# EAGLE design rgb_sensor (EAGLE 6.4)
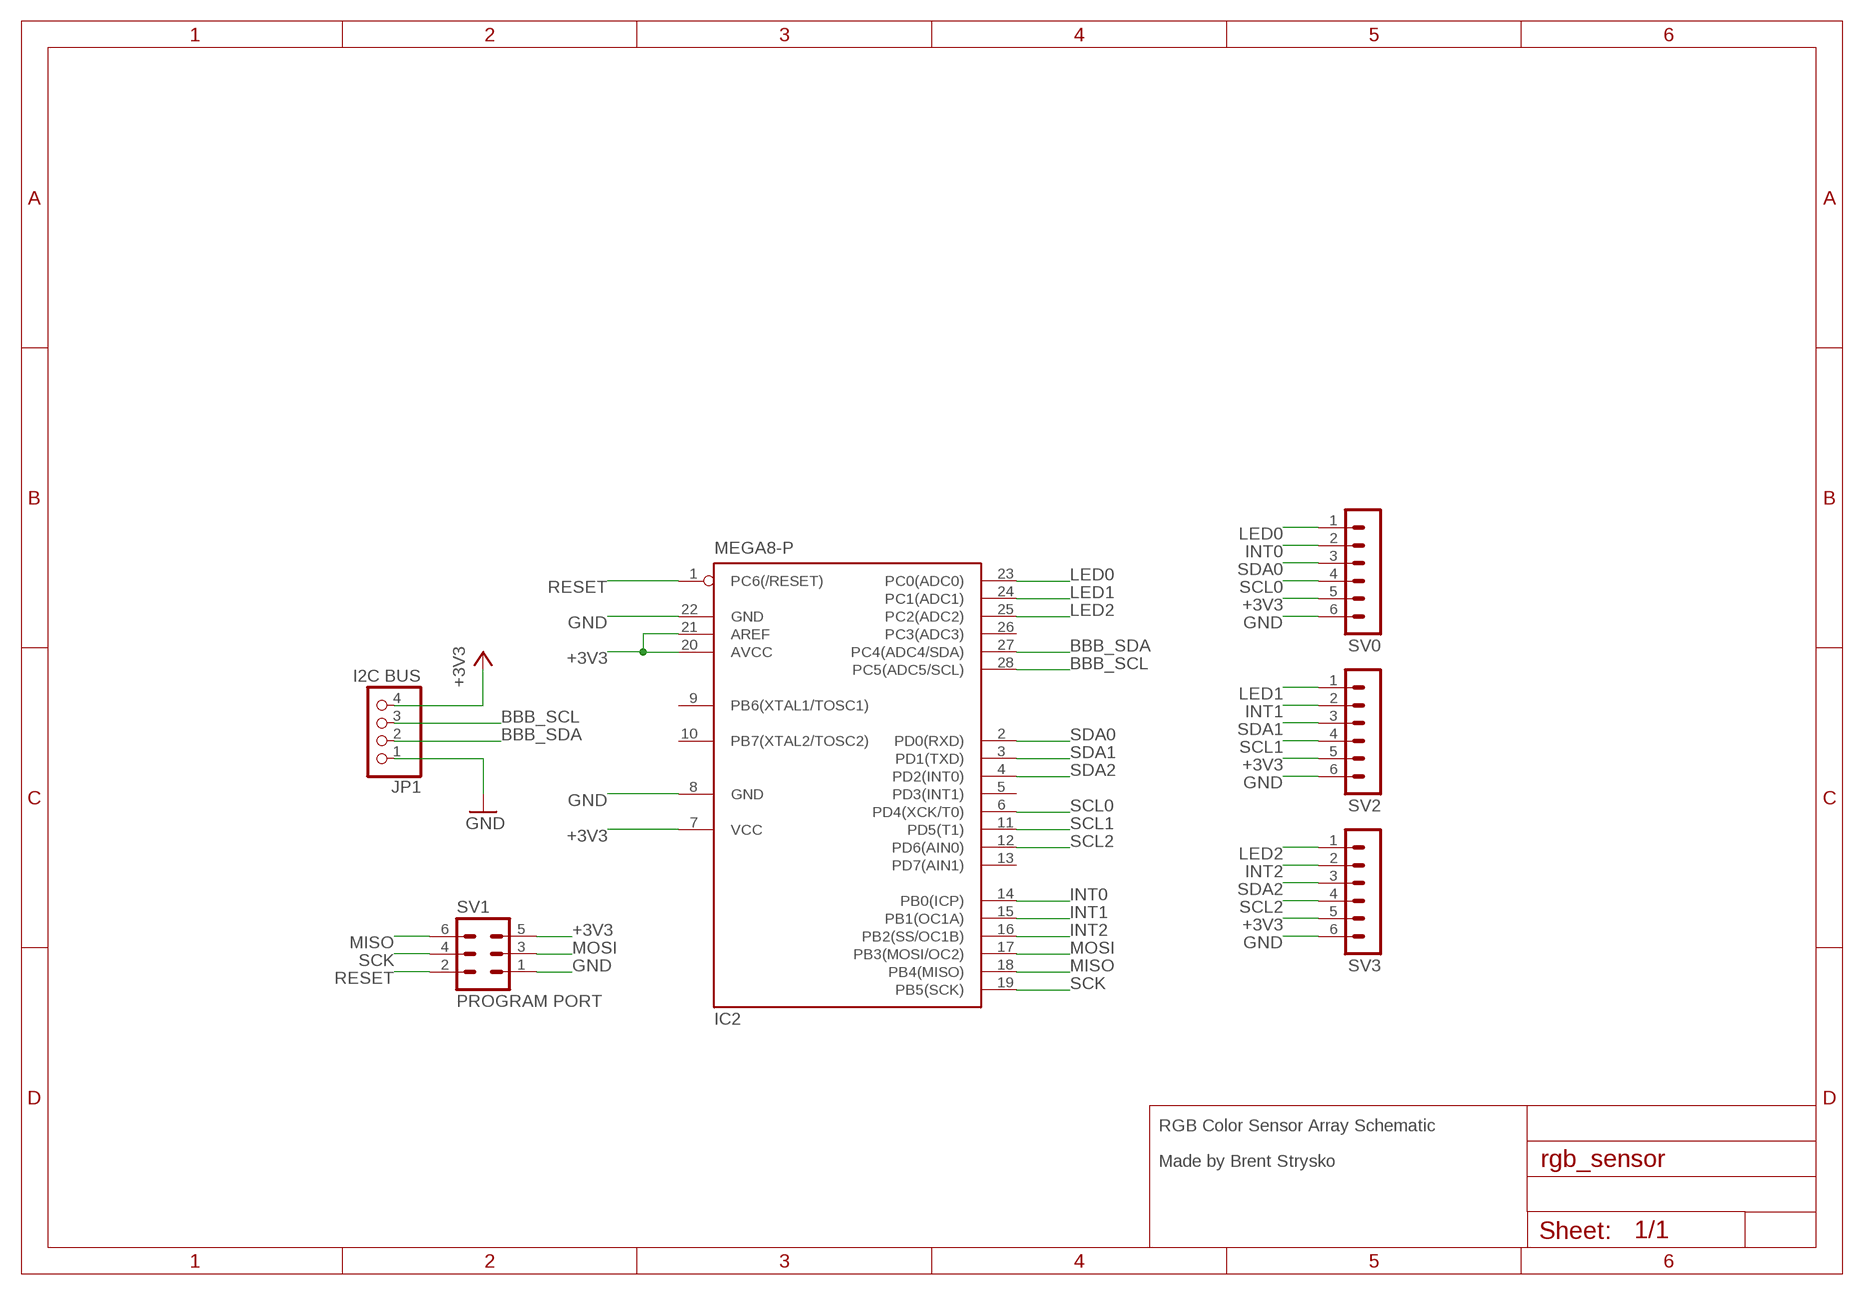
[diagram p0: schematic, sheet 1]

## Parts
IC2  MEGA8-P  [DIL28-3]
JP1  I2C BUS  PINHD-1X4  [1X04]
SV0  MA06-1  [MA06-1]
SV1  PROGRAM PORT  MA03-2  [MA03-2]
SV2  MA06-1  [MA06-1]
SV3  MA06-1  [MA06-1]

## Nets
+3V3: IC2.7(VCC) IC2.20(AVCC) IC2.21(AREF) JP1.4 SV0.5 SV1.5 SV2.5 SV3.5
BBB_SCL: IC2.28(PC5(ADC5/SCL)) JP1.3
BBB_SDA: IC2.27(PC4(ADC4/SDA)) JP1.2
GND: IC2.8(GND) IC2.22(GND) JP1.1 SV0.6 SV1.1 SV2.6 SV3.6
INT0: IC2.14(PB0(ICP)) SV0.2
INT1: IC2.15(PB1(OC1A)) SV2.2
INT2: IC2.16(PB2(SS/OC1B)) SV3.2
LED0: IC2.23(PC0(ADC0)) SV0.1
LED1: IC2.24(PC1(ADC1)) SV2.1
LED2: IC2.25(PC2(ADC2)) SV3.1
MISO: IC2.18(PB4(MISO)) SV1.6
MOSI: IC2.17(PB3(MOSI/OC2)) SV1.3
RESET: IC2.1(PC6(/RESET)) SV1.2
SCK: IC2.19(PB5(SCK)) SV1.4
SCL0: IC2.6(PD4(XCK/T0)) SV0.4
SCL1: IC2.11(PD5(T1)) SV2.4
SCL2: IC2.12(PD6(AIN0)) SV3.4
SDA0: IC2.2(PD0(RXD)) SV0.3
SDA1: IC2.3(PD1(TXD)) SV2.3
SDA2: IC2.4(PD2(INT0)) SV3.3
Unconnected: IC2.5(PD3(INT1)) IC2.9(PB6(XTAL1/TOSC1)) IC2.10(PB7(XTAL2/TOSC2)) IC2.13(PD7(AIN1)) IC2.26(PC3(ADC3))

## Notes on the sheet
- RGB Color Sensor Array Schematic
- Made by Brent Strysko

## Library data of the parts
IC2 = atmel:MEGA8-P: MICROCONTROLLER 8 Kbytes FLASH, 1 kbytes SRAM, 512 bytes EEPROM, USART, 4-channel 10 bit ADC, 2-channel 8 bit ADC Pin compatible with Atmega48, ATMega88, ATMega168 Source: avr.lbr; OC_FARNELL: unknown; OC_NEWARK: unknown
JP1 = pinhead:PINHD-1X4: PIN HEADER
SV0 SV2 SV3 = con-lstb:MA06-1: PIN HEADER; OC_FARNELL: unknown; OC_NEWARK: unknown
SV1 = con-lstb:MA03-2: PIN HEADER; OC_FARNELL: unknown; OC_NEWARK: unknown

## Board
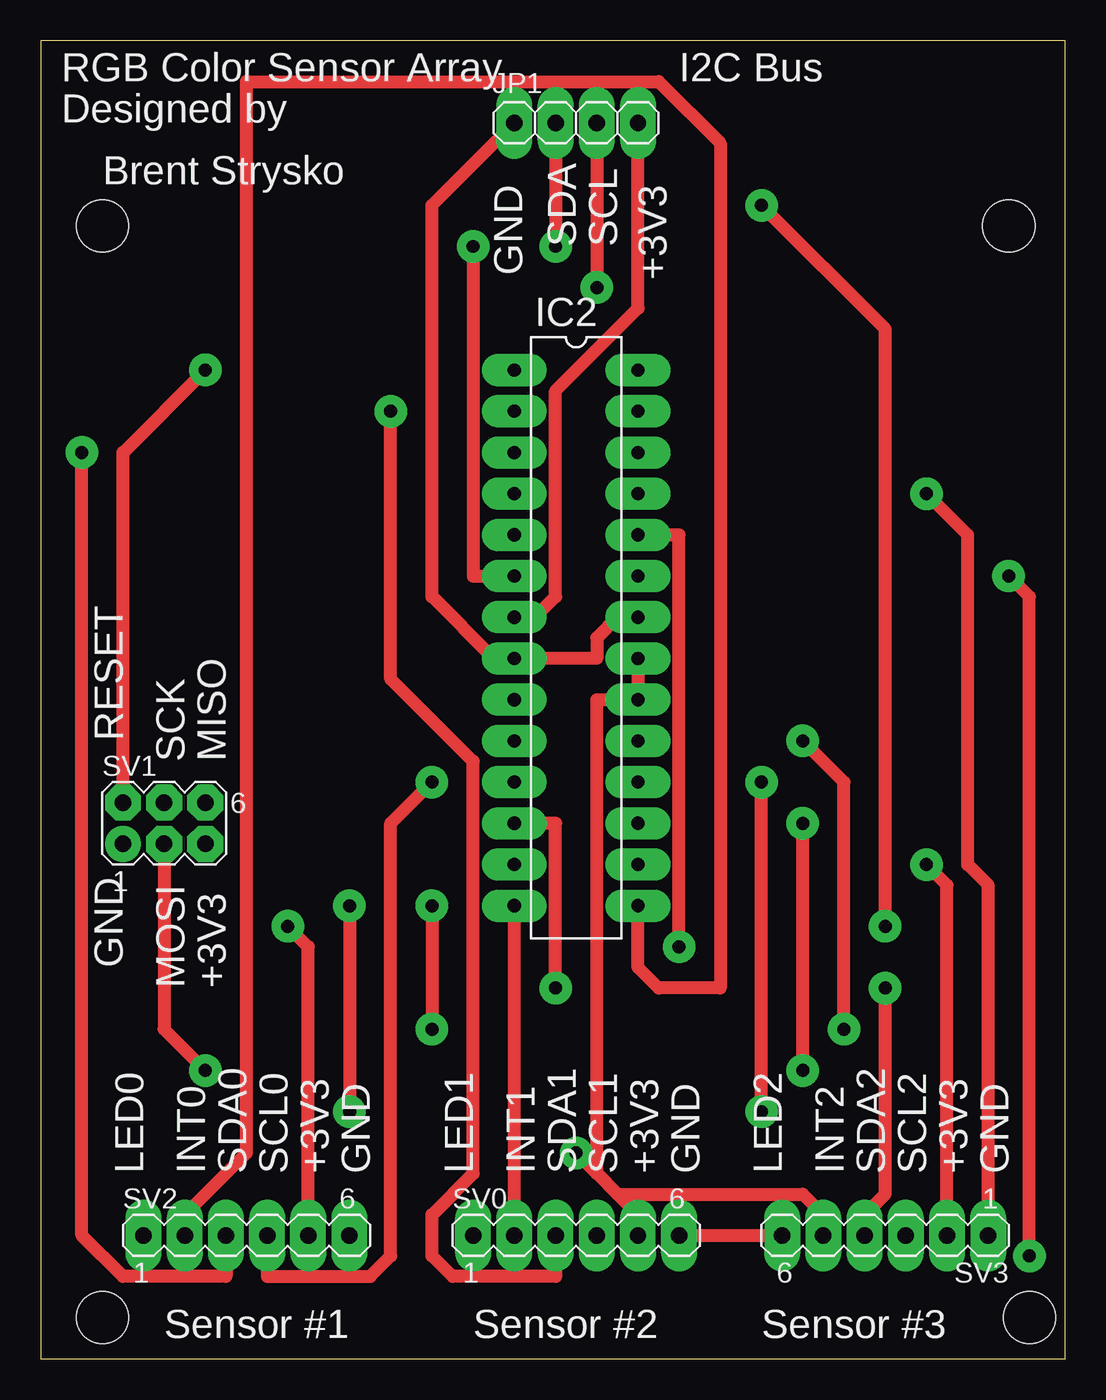
[diagram p1: board, top side]
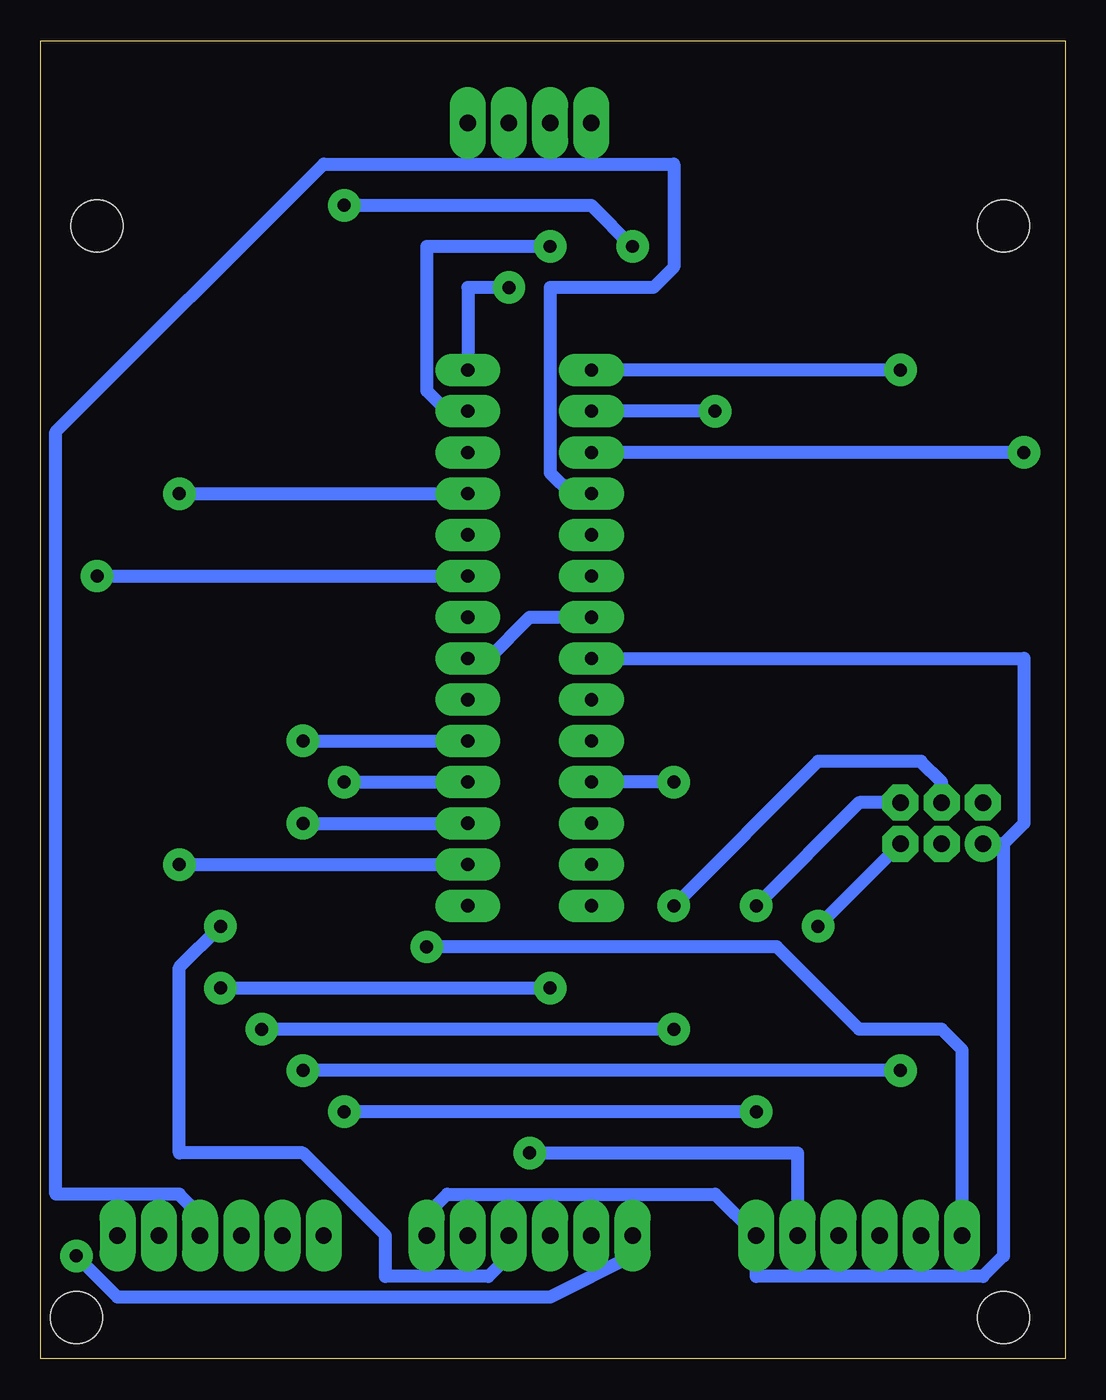
[diagram p2: board, bottom side, seen from below]

Size 63.17 x 81.27 mm. Coordinates in mm from the lower left corner, seen from the top.
Outline: 0,0 63.17,0 63.17,81.27 0,81.27 0,0
Copper layers (1*16): Top 0.035mm / dielectric 1.5mm / Bottom 0.035mm
Design rules "FJ043CWRTMEP27Y3QS": minimum track width 0.8mm, minimum drill 0.8mm, track to track 0.8mm, track to pad 0.8mm, pad to pad 0.45mm, via to via 0.8mm, smd to smd 8mil, copper to edge 10mil, drill to drill 8mil, minimum pad ring 0.6mm, minimum via ring 0.6mm, stop-mask expansion 0mil, vias tented up to drill 0mil, thermal gap 10mil
Holes 3.2 mm at 59.69,69.85 60.96,2.54 3.81,2.54 3.81,69.85

### Footprints (pad centres in the part's own frame; a part is rotated, then mirrored left to right if it is on the bottom)
DIL28-3 = drill 0.813 long: 1 -16.51,-3.81; 2 -13.97,-3.81; 3 -11.43,-3.81; 4 -8.89,-3.81; 5 -6.35,-3.81; 6 -3.81,-3.81; 7 -1.27,-3.81; 8 1.27,-3.81; 9 3.81,-3.81; 10 6.35,-3.81; 11 8.89,-3.81; 12 11.43,-3.81; 13 13.97,-3.81; 14 16.51,-3.81; 15 16.51,3.81; 16 13.97,3.81; 17 11.43,3.81; 18 8.89,3.81; 19 6.35,3.81; 20 3.81,3.81; 21 1.27,3.81; 22 -1.27,3.81; 23 -3.81,3.81; 24 -6.35,3.81; 25 -8.89,3.81; 26 -11.43,3.81; 27 -13.97,3.81; 28 -16.51,3.81
1X04 = drill 1.016 long: 1 -3.81,0; 2 -1.27,0; 3 1.27,0; 4 3.81,0
MA06-1 = drill 1.016 long: 1 -6.35,0; 2 -3.81,0; 3 -1.27,0; 4 1.27,0; 5 3.81,0; 6 6.35,0
MA03-2 = drill 1.016: 1 -2.54,-1.27 | drill 1.016 octagon: 2 -2.54,1.27; 3 0,-1.27; 4 0,1.27; 5 2.54,-1.27; 6 2.54,1.27

### Placement (x,y rotation side)
IC2  33.02,44.45 270 top
JP1  33.02,76.2 0 top
SV0  33.02,7.62 0 top
SV1  7.62,33.02 0 top
SV2  12.7,7.62 0 top
SV3  52.07,7.62 180 top

### Tracks (layer width: path | path; a pad name or v marks a point on that pad's centre or on a via)
+3V3  (via drill 0.8)
  Top 0.8: IC2.21 IC2.20 34.29,40.64 34.29,11.43 | JP1.4 36.83,64.77 31.75,59.69 31.75,46.99 30.48,45.72 IC2.7 | 35.56,10.16 36.83,8.89 SV0.5 | 35.56,10.16 34.29,11.43 | 34.29,11.43 v33.02,12.7 | v15.24,26.67 16.51,25.4 SV2.5 | SV3.5 48.26,8.89 46.99,10.16 35.56,10.16
  Bottom 0.8: IC2.7 33.02,45.72 35.56,43.18 IC2.21 | SV2.5 16.51,12.7 v33.02,12.7 | v15.24,26.67 SV1.5
BBB_SCL  (via drill 0.8)
  Top 0.8: JP1.3 v34.29,66.04
  Bottom 0.8: IC2.28 36.83,66.04 v34.29,66.04
BBB_SDA  (via drill 0.8)
  Top 0.8: JP1.2 v31.75,68.58
  Bottom 0.8: IC2.27 38.1,58.42 39.37,59.69 39.37,68.58 v31.75,68.58
GND
  Top 0.8: SV0.6 SV3.6 | IC2.22 35.56,45.72 34.29,44.45 34.29,43.18 IC2.8 27.94,43.18 24.13,46.99 24.13,71.12 JP1.1
  Bottom 0.8: SV0.6 39.37,8.89 38.1,10.16 21.59,10.16 SV2.6 19.05,5.08 5.08,5.08 3.81,6.35 3.81,31.75 | 3.81,31.75 SV1.1 | 3.81,31.75 2.54,33.02 2.54,43.18 IC2.8
INT0
  Top 0.8: SV0.2 IC2.14
INT1
  Top 0.8: IC2.15 36.83,24.13 38.1,22.86 41.91,22.86 41.91,74.93 38.1,78.74 12.7,78.74 12.7,12.7 8.89,8.89 SV2.2
INT2  (via drill 0.8)
  Top 0.8: v54.61,30.48 55.88,29.21 SV3.2
  Bottom 0.8: v54.61,30.48 IC2.16
LED0  (via drill 0.8)
  Top 0.8: v59.69,48.26 60.96,46.99 v60.96,6.35
  Bottom 0.8: v59.69,48.26 IC2.23 | v60.96,6.35 58.42,3.81 31.75,3.81 26.67,6.35 SV0.1
LED1  (via drill 0.8)
  Top 0.8: IC2.24 39.37,50.8 v39.37,25.4
  Bottom 0.8: v39.37,25.4 17.78,25.4 12.7,20.32 7.62,20.32 6.35,19.05 SV2.1
LED2  (via drill 0.8)
  Top 0.8: v54.61,53.34 57.15,50.8 57.15,30.48 58.42,29.21 SV3.1
  Bottom 0.8: v54.61,53.34 IC2.25
MISO  (via drill 0.8)
  Top 0.8: v44.45,15.24 v44.45,35.56 | v19.05,27.94 v19.05,15.24
  Bottom 0.8: v44.45,35.56 IC2.18 | v19.05,15.24 v44.45,15.24 | v19.05,27.94 12.7,34.29 SV1.6
MOSI  (via drill 0.8)
  Top 0.8: v46.99,17.78 v46.99,33.02 | v10.16,17.78 7.62,20.32 SV1.3
  Bottom 0.8: v46.99,33.02 IC2.17 | v10.16,17.78 v46.99,17.78
RESET  (via drill 0.8)
  Top 0.8: v10.16,60.96 5.08,55.88 SV1.2
  Bottom 0.8: v10.16,60.96 IC2.1
SCK  (via drill 0.8)
  Top 0.8: v46.99,38.1 49.53,35.56 v49.53,20.32 | v24.13,27.94 v24.13,20.32
  Bottom 0.8: v46.99,38.1 IC2.19 | v24.13,20.32 v49.53,20.32 | v24.13,27.94 15.24,36.83 8.89,36.83 7.62,35.56 SV1.4
SCL0  (via drill 0.8)
  Top 0.8: IC2.6 26.67,48.26 v26.67,68.58 | v44.45,71.12 52.07,63.5 v52.07,26.67
  Bottom 0.8: v26.67,68.58 29.21,71.12 v44.45,71.12 | v52.07,26.67 54.61,24.13 54.61,12.7 46.99,12.7 41.91,7.62 41.91,5.08 35.56,5.08 34.29,6.35 SV0.4
SCL1  (via drill 0.8)
  Top 0.8: v24.13,35.56 21.59,33.02 21.59,6.35 20.32,5.08 13.97,5.08 SV2.4
  Bottom 0.8: v24.13,35.56 IC2.11
SCL2  (via drill 0.8)
  Top 0.8: IC2.12 31.75,33.02 v31.75,22.86 | v52.07,22.86 52.07,10.16 50.8,8.89 SV3.4
  Bottom 0.8: v52.07,22.86 v31.75,22.86
SDA0  (via drill 0.8)
  Top 0.8: v21.59,58.42 21.59,41.91 26.67,36.83 26.67,11.43 24.13,8.89 24.13,6.35 25.4,5.08 31.75,5.08 SV0.3
  Bottom 0.8: v21.59,58.42 IC2.2
SDA1  (via drill 0.8)
  Top 0.8: v2.54,55.88 2.54,7.62 5.08,5.08 11.43,5.08 SV2.3
  Bottom 0.8: v2.54,55.88 IC2.3
SDA2
  Bottom 0.8: IC2.4 30.48,53.34 31.75,54.61 31.75,66.04 25.4,66.04 24.13,67.31 24.13,73.66 45.72,73.66 62.23,57.15 62.23,10.16 54.61,10.16 53.34,8.89 SV3.3

### Text on the board
tPlace: RGB Color Sensor Array | I2C Bus | Designed by | Brent Strysko | GND | +3V3 | SDA | SCL | RESET | SCK | MISO | GND | MOSI | +3V3 | LED0 | INT0 | SDA0 | SCL0 | +3V3 | GND | LED1 | INT1 | SDA1 | SCL1 | +3V3 | GND | LED2 | INT2 | SDA2 | SCL2 | +3V3 | GND | Sensor #1 | Sensor #2 | Sensor #3